# Altium schematic sheet STM32_POWER.SchDoc: STM32_POWER
size B; Organization: Myomo; Address3: USA; SheetNumber: 8
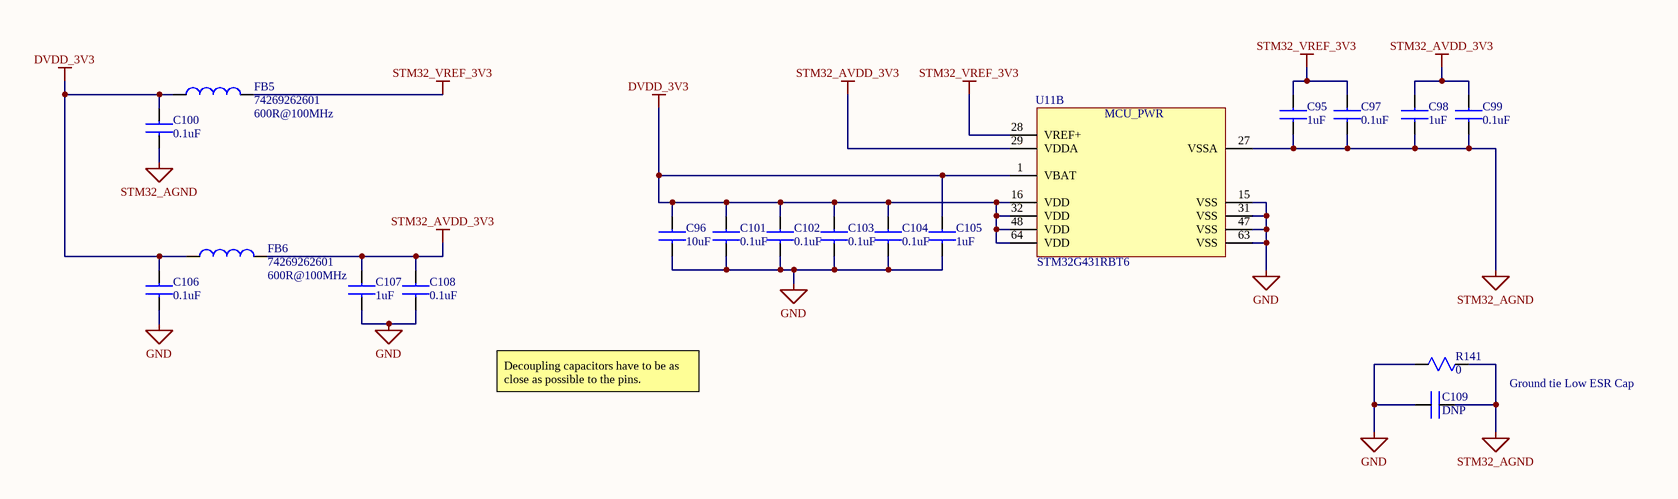
[diagram p0: STM32_POWER.SchDoc]

## Parts
C95  1uF  [0603]
C96  10uF  [1210]
C97  0.1uF  [0402]
C98  1uF  [0603]
C99  0.1uF  [0402]
C100  0.1uF  [0402]
C101  0.1uF  [0402]
C102  0.1uF  [0402]
C103  0.1uF  [0402]
C104  0.1uF  [0402]
C105  1uF  [0603]
C106  0.1uF  [0402]
C107  1uF  [0603]
C108  0.1uF  [0402]
C109  DNP  [0603]  (no BOM)
FB5  74269262601  [0603]
FB6  74269262601  [0603]
R141  0  [0603]
U11  STM32G431RBT6  [U_STM32G431R]  (part B of 2)

## Nets
DVDD_3V3: C96.1 C100.1 C101.1 C102.1 C103.1 C104.1 C105.1 C106.1 FB5.1 FB6.1 U11.1(VBAT) U11.16(VDD) U11.32(VDD) U11.48(VDD) U11.64(VDD)
GND: C96.2 C101.2 C102.2 C103.2 C104.2 C105.2 C106.2 C107.2 C108.2 C109.1 R141.1 U11.15(VSS) U11.31(VSS) U11.47(VSS) U11.63(VSS)
STM32_AGND: C95.2 C97.2 C98.2 C99.2 C100.2 C109.2 R141.2 U11.27(VSSA)
STM32_AVDD_3V3: C98.1 C99.1 C107.1 C108.1 FB6.2 U11.29(VDDA)
STM32_VREF_3V3: C95.1 C97.1 FB5.2 U11.28(VREF+)

## Notes on the sheet
- Decoupling capacitors have to be as close as possible to the pins.
- Ground tie Low ESR Cap
- TITLE:
- NAME
- DATE
- PCA REVISION:
- PCA NAME:
- APPROVED BY:
- DESIGNED BY:
- PCA NUMBER:
- DATE:
- TIME:
- DOCUMENT SIZE:
- SHEET:
- OF
- B
- PROPRIETARY AND CONFIDENTIAL
  THIS DOCUMENT AND THE DATA CONTAINED HEREIN OR HEREWITH IS NOT TO BE REPRODUCED, USED, OR DISCLOSED, IN WHOLE OR IN PART, WITHOUT THE PERMISSION OF
  MYOMO, INC.
- (in symbol FB_0603 _600_100MHz_1.5A) 600R@100MHz
- (in symbol U_STM32G431R, part B) MCU_PWR

## Library data of the parts
C95 C98 C105 C107 = C_0603_CER_1uF_50V_X7R: CAP CER 1UF 50V X7R 0603; MFG: YAGEO; MFGPN: CC0603KRX7R9BB105; Myomo PN: 201-0006
C96 = C_1210_CER_10uF_25V_X7R: CAP CER 10UF 25V X7R 1210; MFG: SUMSUNG; MFGPN: CL32B106KAJNNNE; Myomo PN: 201-0004
C97 C99-C104 C106 C108 = C_0402_CER_0.1uF_50V_X7R: CAP CER 0.1UF 50V X7R 0402; MFG: Samsung; MFGPN: CL05B104KB54PNC; Myomo PN: 201-0017
C109 = C_0603_DNP: CAP CER 0603 DNP
FB5 FB6 = FB_0603 _600_100MHz_1.5A: 600 Ohms @ 100 MHz 1 Power Line Ferrite Bead 0603 (1608 Metric) 1.5A 100mOhm; MFG: Wurth Elektronik; Myomo PN: 202-0001; MFGPN: 74269262601
R141 = R_0603_0: RES 0 OHM JUMPER 1/10W 0603; MFG: YAGEO; MFGPN: RC0603FR-070RL; Myomo PN: 200-0007
U11 = U_STM32G431R: STM32G431, LQFP64 package; MFG: STMicroelectronics; Myomo PN: 204-0012; MFGPN: STM32G431RBT6